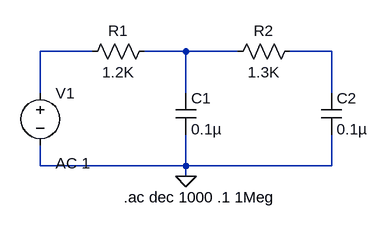
[diagram p0: schematic Project1 Real Components Schematic.asc]
Project1 Real Components Schematic.asc, the LTspice schematic file:
Version 4
SHEET 1 880 680
WIRE 32 96 -48 96
WIRE 176 96 112 96
WIRE 256 96 176 96
WIRE 400 96 336 96
WIRE -48 160 -48 96
WIRE 176 160 176 96
WIRE 400 160 400 96
WIRE -48 272 -48 240
WIRE 176 272 176 224
WIRE 176 272 -48 272
WIRE 400 272 400 224
WIRE 400 272 176 272
WIRE 176 288 176 272
FLAG 176 288 0
SYMBOL res 128 80 R90
WINDOW 0 0 56 VBottom 2
WINDOW 3 32 56 VTop 2
SYMATTR InstName R1
SYMATTR Value 1.2K
SYMATTR SpiceLine tol=1 pwr=0.1
SYMBOL res 352 80 R90
WINDOW 0 0 56 VBottom 2
WINDOW 3 32 56 VTop 2
SYMATTR InstName R2
SYMATTR Value 1.3K
SYMATTR SpiceLine tol=1 pwr=0.1
SYMBOL cap 160 160 R0
SYMATTR InstName C1
SYMATTR Value 0.1µ
SYMATTR SpiceLine V=4 Irms=1.62 Rser=0.0464862 Lser=0 mfg="KEMET" pn="C0402C104K7PAC" type="X5R"
SYMBOL cap 384 160 R0
SYMATTR InstName C2
SYMATTR Value 0.1µ
SYMATTR SpiceLine V=4 Irms=1.62 Rser=0.0464862 Lser=0 mfg="KEMET" pn="C0402C104K7PAC" type="X5R"
SYMBOL voltage -48 144 R0
WINDOW 123 24 124 Left 2
WINDOW 39 0 0 Left 2
SYMATTR Value2 AC 1
SYMATTR InstName V1
SYMATTR Value ""
TEXT 80 320 Left 2 !.ac dec 1000 .1 1Meg

The netlist it stands for:
* Project1 Real Components Schematic.asc
R1 N002 N001 1.2K tol=1 pwr=0.1
R2 N003 N002 1.3K tol=1 pwr=0.1
C1 N002 0 0.1µ V=4 Irms=1.62 Rser=0.0464862 Lser=0 mfg="KEMET" pn="C0402C104K7PAC" type="X5R"
C2 N003 0 0.1µ V=4 Irms=1.62 Rser=0.0464862 Lser=0 mfg="KEMET" pn="C0402C104K7PAC" type="X5R"
V1 N001 0 AC 1
.ac dec 1000 .1 1Meg
.backanno
.end